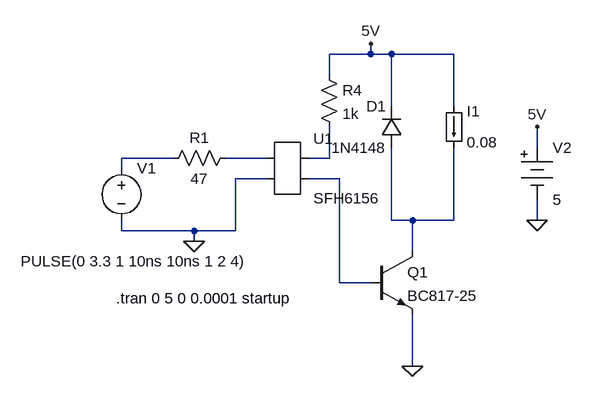
[diagram p0: schematic relay.asc]
relay.asc, the LTspice schematic file:
Version 4
SHEET 1 1088 680
WIRE 496 176 496 160
WIRE 496 176 432 176
WIRE 528 176 496 176
WIRE 624 176 528 176
WIRE 432 208 432 176
WIRE 528 256 528 176
WIRE 624 256 624 176
WIRE 752 320 752 288
WIRE 192 336 112 336
WIRE 336 336 272 336
WIRE 432 336 432 288
WIRE 432 336 400 336
WIRE 112 352 112 336
WIRE 336 368 288 368
WIRE 448 368 400 368
WIRE 528 432 528 320
WIRE 560 432 528 432
WIRE 624 432 624 320
WIRE 624 432 560 432
WIRE 752 432 752 400
WIRE 112 448 112 432
WIRE 224 448 112 448
WIRE 288 448 288 368
WIRE 288 448 224 448
WIRE 224 464 224 448
WIRE 560 480 560 432
WIRE 448 528 448 368
WIRE 496 528 448 528
WIRE 560 656 560 576
FLAG 224 464 0
FLAG 496 160 5V
FLAG 752 432 0
FLAG 752 288 5V
FLAG 560 656 0
SYMBOL voltage 112 336 R0
WINDOW 3 -155 159 Left 2
SYMATTR Value PULSE(0 3.3 1 10ns 10ns 1 2 4)
SYMATTR InstName V1
SYMBOL res 288 320 R90
WINDOW 0 0 56 VBottom 2
WINDOW 3 32 56 VTop 2
SYMATTR InstName R1
SYMATTR Value 47
SYMBOL Misc/battery 752 304 R0
SYMATTR InstName V2
SYMATTR Value 5
SYMBOL AutoGenerated/SFH6156 368 352 R0
SYMATTR InstName U1
SYMATTR SpiceLine REL_CTR=1.67
SYMBOL npn 496 480 R0
SYMATTR InstName Q1
SYMATTR Value BC817-25
SYMBOL load 608 256 R0
SYMATTR InstName I1
SYMATTR Value 0.08
SYMBOL diode 544 320 R180
WINDOW 0 24 64 Left 2
WINDOW 3 24 0 Left 2
SYMATTR InstName D1
SYMATTR Value 1N4148
SYMBOL res 416 192 R0
SYMATTR InstName R4
SYMATTR Value 1k
TEXT 104 552 Left 2 !.tran 0 5 0 0.0001 startup

The netlist it stands for:
* relay.asc
V1 N001 0 PULSE(0 3.3 1 10ns 10ns 1 2 4)
R1 N002 N001 47
V2 5V 0 5
* U1: SFH6156 REL_CTR=1.67 (symbol AutoGenerated/SFH6156 not available, pins judged from their places): pin1=N002 pin2=0 pin3=N003 pin4=N004
Q1 N005 N004 0 0 BC817-25
I1 5V N005 0.08
D1 N005 5V 1N4148
R4 5V N003 1k
.model D D
.lib standard.dio
.model NPN NPN
.model PNP PNP
.lib standard.bjt
.tran 0 5 0 0.0001 startup
.backanno
.end